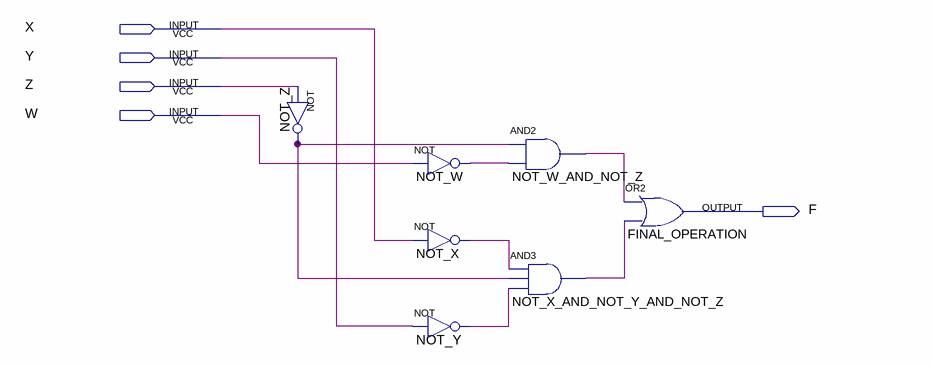
[diagram p0: schematic sheet]
// Quartus schematic Project.bdf as structural Verilog: 7 symbols, 5 pins
module Project (
  input  X,
  input  Y,
  input  Z,
  input  W,
  output F
);

  wire NOT_W_AND_NOT_Z_out, NOT_W_out, NOT_X_AND_NOT_Y_AND_NOT_Z_out, NOT_X_out, NOT_Y_out, NOT_Z_out;

  not NOT_Z (NOT_Z_out, Z);
  not NOT_W (NOT_W_out, W);
  not NOT_X (NOT_X_out, X);
  not NOT_Y (NOT_Y_out, Y);
  and NOT_W_AND_NOT_Z (NOT_W_AND_NOT_Z_out, NOT_Z_out, NOT_W_out);
  and NOT_X_AND_NOT_Y_AND_NOT_Z (NOT_X_AND_NOT_Y_AND_NOT_Z_out, NOT_X_out, NOT_Z_out, NOT_Y_out);
  or FINAL_OPERATION (F, NOT_W_AND_NOT_Z_out, NOT_X_AND_NOT_Y_AND_NOT_Z_out);
endmodule
